# EAGLE design dm_in (EAGLE 6.5.0)
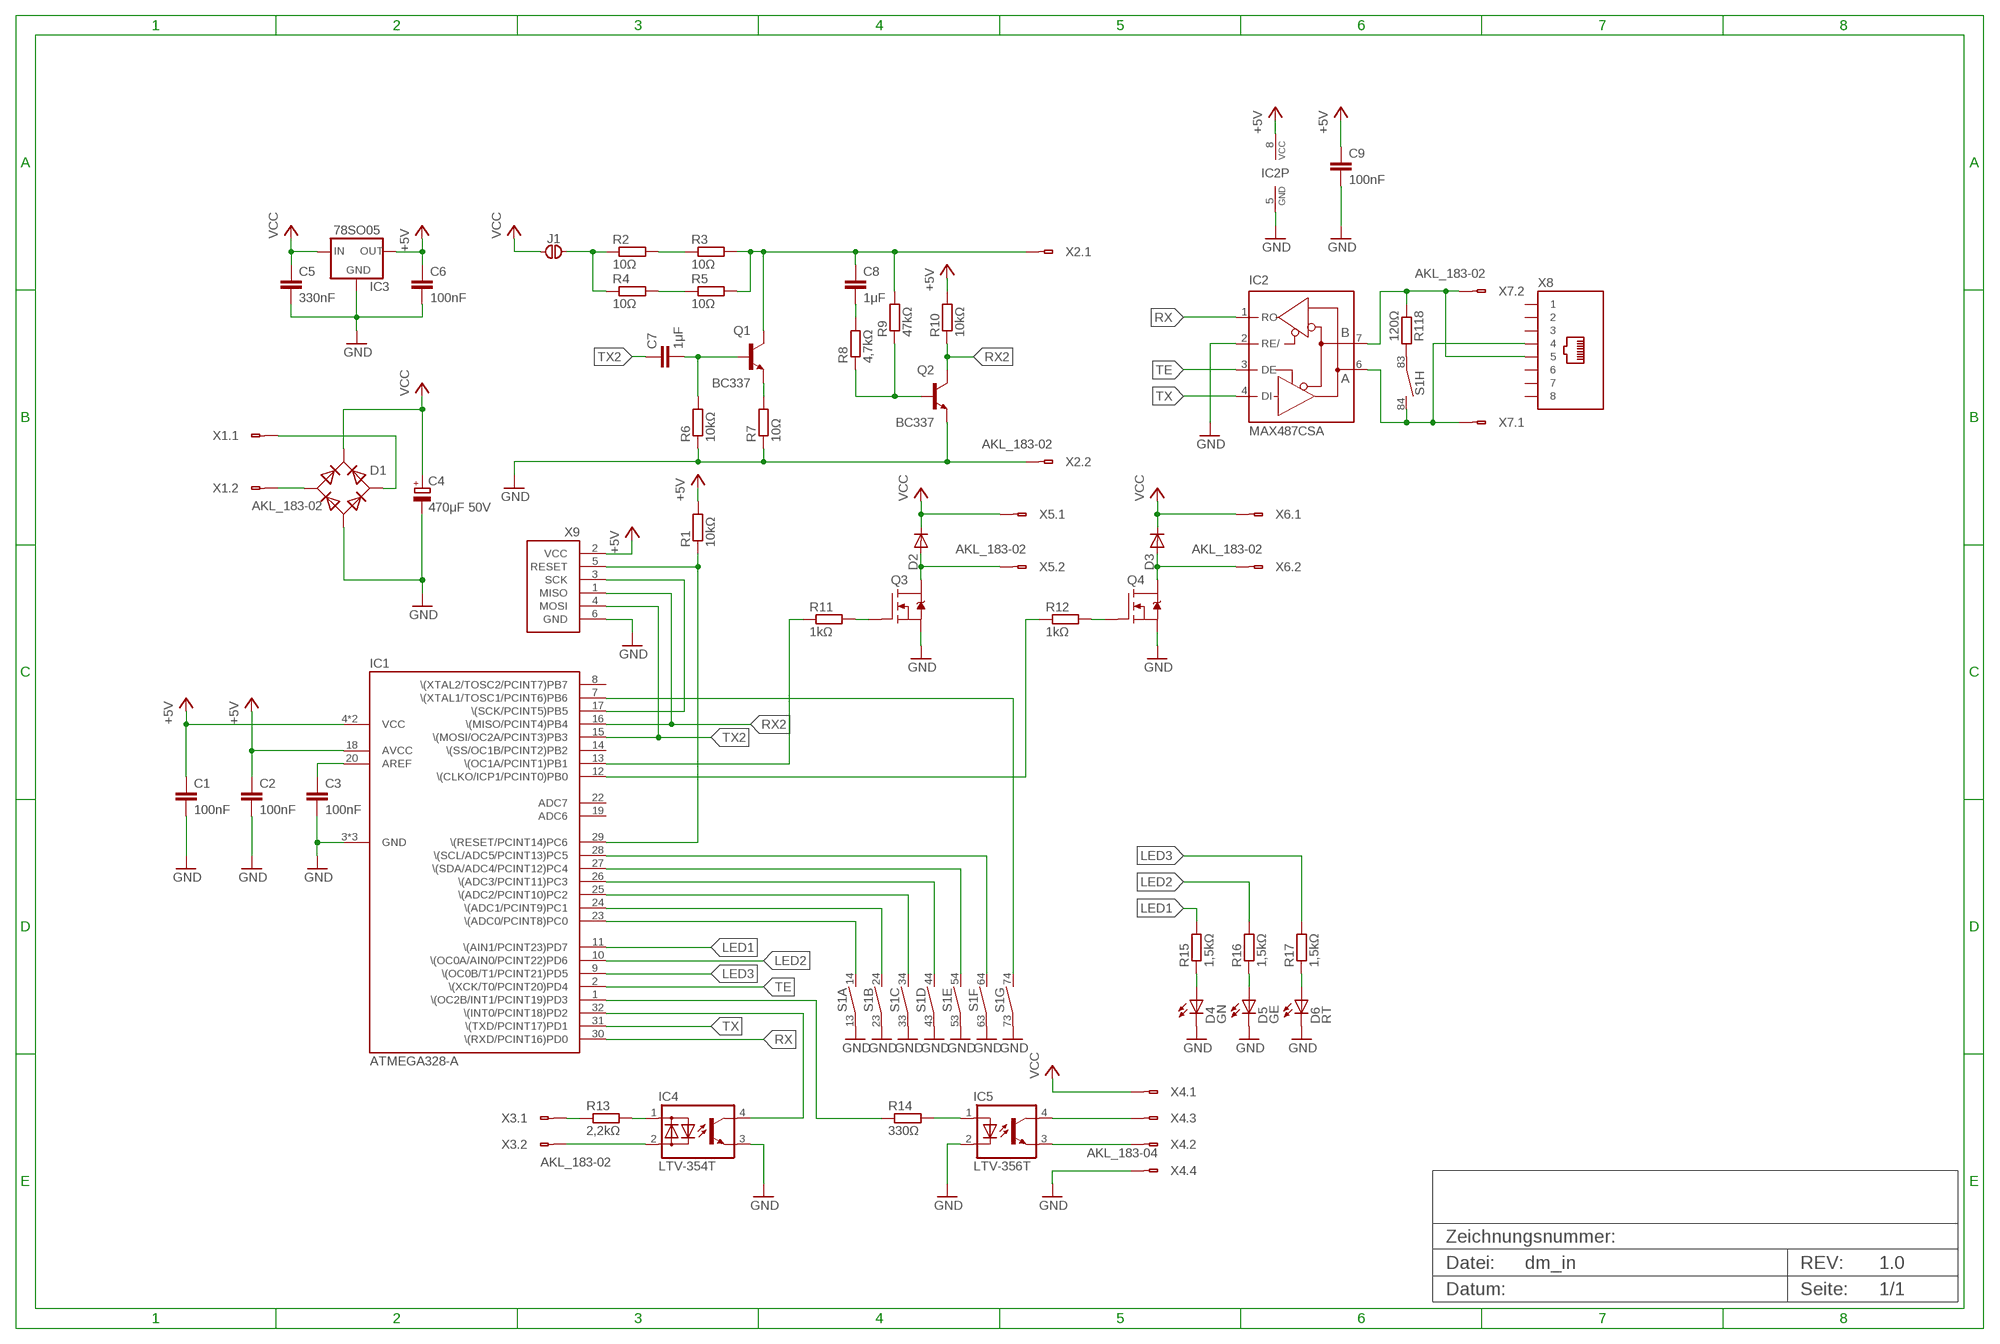
[diagram p0: schematic, sheet 1]

## Parts
C1  100nF  C_0603  [CHIP_0603]
C2  100nF  C_0603  [CHIP_0603]
C3  100nF  C_0603  [CHIP_0603]
C4  470μF 50V  C_EL_E5-13  [E5-13]
C5  330nF  C_0805  [CHIP_0805]
C6  100nF  C_0805  [CHIP_0805]
C7  1μF  C_1206  [CHIP_1206]
C8  1μF  C_1206  [CHIP_1206]
C9  100nF  C_0603  [CHIP_0603]
D1  GLEICHRICHTER-SDIP  [SDIP04_508]
D2  DIODE-SOD123  [SOD123]
D3  DIODE-SOD123  [SOD123]
D4  GN  LED_0805  [CHIP_0805]
D5  GE  LED_0805  [CHIP_0805]
D6  RT  LED_0805  [CHIP_0805]
IC1  ATMEGA328-A  [QFP32_08]
IC2  MAX487CSA  [SOP08_127]
IC3  78SO05  [SOP08_127]
IC4  LTV-354T  [SOP04_254]
IC5  LTV-356T  [SOP04_254]
J1  JUMPER  [JUMPER2]
Q1  BC337  NPN-SOT23-BEC  [SOT23]
Q2  BC337  NPN-SOT23-BEC  [SOT23]
Q3  N-MOS-SOT23-GSD  [SOT23]
Q4  N-MOS-SOT23-GSD  [SOT23]
R1  10kΩ  R_0603  [CHIP_0603]
R2  10Ω  R_1206  [CHIP_1206]
R3  10Ω  R_1206  [CHIP_1206]
R4  10Ω  R_1206  [CHIP_1206]
R5  10Ω  R_1206  [CHIP_1206]
R6  10kΩ  R_0603  [CHIP_0603]
R7  10Ω  R_1206  [CHIP_1206]
R8  4,7kΩ  R_0603  [CHIP_0603]
R9  47kΩ  R_0603  [CHIP_0603]
R10  10kΩ  R_0603  [CHIP_0603]
R11  1kΩ  R_0603  [CHIP_0603]
R12  1kΩ  R_0603  [CHIP_0603]
R13  2,2kΩ  R_0603  [CHIP_0603]
R14  330Ω  R_0603  [CHIP_0603]
R15  1,5kΩ  R_0603  [CHIP_0603]
R16  1,5kΩ  R_0603  [CHIP_0603]
R17  1,5kΩ  R_0603  [CHIP_0603]
R118  120Ω  R_0805  [CHIP_0805]
S1  DP08D  [DIP08_SMD]
X1  AKL_183-02  [AKL_183-02]
X2  AKL_183-02  [AKL_183-02]
X3  AKL_183-02  [AKL_183-02]
X4  AKL_183-04  [AKL_183-04]
X5  AKL_183-02  [AKL_183-02]
X6  AKL_183-02  [AKL_183-02]
X7  AKL_183-02  [AKL_183-02]
X8  8P8C  [C-BMJ-0102]
X9  ISP-AVR6  [ML6]

## Nets
+5V: C1.1 C2.1 C6.1 C9.1 IC1.4(VCC) IC1.6(VCC) IC1.18(AVCC) IC2.8(VCC) IC3.1(OUT) R1.2 R10.2 X9.2(VCC)
GND: C1.2 C2.2 C3.2 C4.- C5.2 C6.2 C9.2 D1.2(-) D4.2(C) D5.2(C) D6.2(C) IC1.3(GND) IC1.5(GND) IC1.21(GND) IC2.2(RE/) IC2.5(GND) IC3.2(GND) IC3.3(GND) IC3.6(GND) IC3.7(GND) IC4.3(E) IC5.2(K) Q2.2(E) Q3.2(S) Q4.2(S) R6.1 R7.1 S1.13 S1.23 S1.33 S1.43 S1.53 S1.63 S1.73 X2.2 X4.4 X9.6(GND)
LED1: IC1.11(\(AIN1/PCINT23)PD7) R15.2
LED2: IC1.10(\(OC0A/AIN0/PCINT22)PD6) R16.2
LED3: IC1.9(\(OC0B/T1/PCINT21)PD5) R17.2
N$1: IC1.32(\(INT0/PCINT18)PD2) IC4.4(C)
N$2: IC4.2(K) X3.2
N$3: IC2.6(A) S1.84 X7.1 X8.P$4
N$4: IC1.29(\(RESET/PCINT14)PC6) R1.1 X9.5(RESET)
N$5: IC1.13(\(OC1A/PCINT1)PB1) R11.1
N$6: Q3.1(G) R11.2
N$7: D2.A Q3.3(D) X5.2
N$8: IC5.3(E) X4.2
N$9: IC5.4(C) X4.3
N$10: IC1.1(\(OC2B/INT1/PCINT19)PD3) R14.1
N$11: IC5.1(A) R14.2
N$12: J1.P$2 R2.1 R4.1
N$13: R2.2 R3.1
N$14: R13.1 X3.1
N$15: IC4.1(A) R13.2
N$16: Q1.2(E) R7.2
N$17: C7.2 Q1.1(B) R6.2
N$18: Q2.1(B) R8.1 R9.1
N$19: C8.2 R8.2
N$20: D1.4(AC2) X1.1
N$21: C8.1 Q1.3(C) R3.2 R5.2 R9.2 X2.1
N$22: D1.3(AC1) X1.2
N$23: R4.2 R5.1
N$24: Q4.1(G) R12.2
N$25: D3.A Q4.3(D) X6.2
N$26: IC1.12(\(CLKO/ICP1/PCINT0)PB0) R12.1
N$27: IC2.7(B) R118.1 X7.2 X8.P$5
N$28: IC1.23(\(ADC0/PCINT8)PC0) S1.14
N$29: IC1.24(\(ADC1/PCINT9)PC1) S1.24
N$30: IC1.25(\(ADC2/PCINT10)PC2) S1.34
N$31: IC1.26(\(ADC3/PCINT11)PC3) S1.44
N$32: IC1.27(\(SDA/ADC4/PCINT12)PC4) S1.54
N$33: R118.2 S1.83
N$34: IC1.28(\(SCL/ADC5/PCINT13)PC5) S1.64
N$35: IC1.7(\(XTAL1/TOSC1/PCINT6)PB6) S1.74
N$36: D6.1(A) R17.1
N$38: IC1.17(\(SCK/PCINT5)PB5) X9.3(SCK)
N$39: C3.1 IC1.20(AREF)
N$62: D4.1(A) R15.1
N$63: D5.1(A) R16.1
RX: IC1.30(\(RXD/PCINT16)PD0) IC2.1(RO)
RX2: IC1.16(\(MISO/PCINT4)PB4) Q2.3(C) R10.1 X9.1(MISO)
TE: IC1.2(\(XCK/T0/PCINT20)PD4) IC2.3(DE)
TX: IC1.31(\(TXD/PCINT17)PD1) IC2.4(DI)
TX2: C7.1 IC1.15(\(MOSI/OC2A/PCINT3)PB3) X9.4(MOSI)
VCC: C4.+ C5.1 D1.1(+) D2.K D3.K IC3.8(IN) J1.P$1 X4.1 X5.1 X6.1
Unconnected: IC1.8(\(XTAL2/TOSC2/PCINT7)PB7) IC1.14(\(SS/OC1B/PCINT2)PB2) IC1.19(ADC6) IC1.22(ADC7) X8.P$1 X8.P$2 X8.P$3 X8.P$6 X8.P$7 X8.P$8

## Notes on the sheet
- 1.0

## Library data of the parts
C1-C3 C5-C9 = passiv:C_: CAPACITOR, European symbol
C4 = passiv:C_EL_: POLARIZED CAPACITOR, European symbol
D1 = diode:GLEICHRICHTER
D2 D3 = diode:DIODE
D4-D6 = led:LED: LED
IC1 = ic-mcu:ATMEGA328: Microcontroller Typ Flash SRAM EEPROM GPIO ADC DAC PWM Timer Ports ATmega328 <./eagle/doc/ic-mcu/atmega48a_48pa_88a_88pa_168a_168pa_328_328p.pdf> 32kB 2kB 1kB 23 8x 10bit 4x 8bit, 2x 16bit 2x 8bit, 1x 16bit JTAG, USART, I2C, SPI
IC2 = ic-wandler:MAX48*: RS485 TRANSEIVER Datasheet: max1487-max491.pdf <./eagle/doc/ic-wandler/max1487-max491.pdf> Part Number Half- / Fullduplex Datarate (Mbps) Slew-Rate limited Low-Power shutdown Receiver / Driver enable Quiescent current (μA) Number of Receivers un bus MAX481 Half 2.5 No Yes Yes 300 32 MAX483 Half 0.25 Yes Yes Yes 120 32 MAX485 Half 2.5 No No Yes 300 32 MAX487 Half 0.25 Yes Yes Yes 120 128
IC3 = ic-reg:78?*: VOLTAGE REGULATOR
IC4 = ic-optokoppler:LTV-354T: Liteon Optokoppler ltv-354t.pdf <./eagle/doc/ic-optokoppler/ltv-354t.pdf>
IC5 = ic-optokoppler:LTV-356T: Liteon Optokoppler ltv-356t.pdf <./eagle/doc/ic-optokoppler/ltv-356t.pdf>
J1 = schalter:JUMPER
Q1 Q2 = transistor:NPN: NPN Transistor Typ Variant VCEO (V) IC (mA) PD (mW) Source BC337 TO92x-EBC 45 800 625 bc337_338.pdf <./eagle/doc/transistor/bc337_338.pdf> BC546 TO92x-EBC 65 100 625 bc546.pdf <./eagle/doc/transistor/bc546.pdf> BC817 SOT23-BEC 45 500 250 bc817.pdf <./eagle/doc/transistor/bc817.pdf> BD543 TO220x-BCE 40 10A 70W bd543.pdf <./eagle/doc/transistor/bd543.pdf>
Q3 Q4 = transistor:N-MOS: N-Kanal Transistor Typ Variant VDS (V) ID (A) PD (W) Source 2N7002 SOT23-GSD 60 115 mA 200 mW 2n7000.pdf <./eagle/doc/transistor/2n7000.pdf> AO3416 SOT23-GSD 20 6,5 1,4 ao3416.pdf <./eagle/doc/transistor/ao3416.pdf>
R1-R17 R118 = passiv:R_: RESISTOR, European symbol
S1 = schalter:DP08: Piano-Dip-Schalter Datasheet: dp.pdf <./eagle/doc/schalter/dp.pdf>
X1-X3 X5-X7 = anschluss:AKL_183-02: Anschlussklemme Datasheet: akl181-183.pdf <./eagle/doc/anschluss/akl181-183.pdf> Gegenstück: AKL169
X4 = anschluss:AKL_183-04: Anschlussklemme Datasheet: akl181-183.pdf <./eagle/doc/anschluss/akl181-183.pdf> Gegenstück: AKL169
X8 = stecker:8P8C
X9 = stecker:ISP

## Net classes
2 buspower: clearance 0.5 mm to class 0, clearance 3 mm to class 1, clearance 0.5 mm

## Board
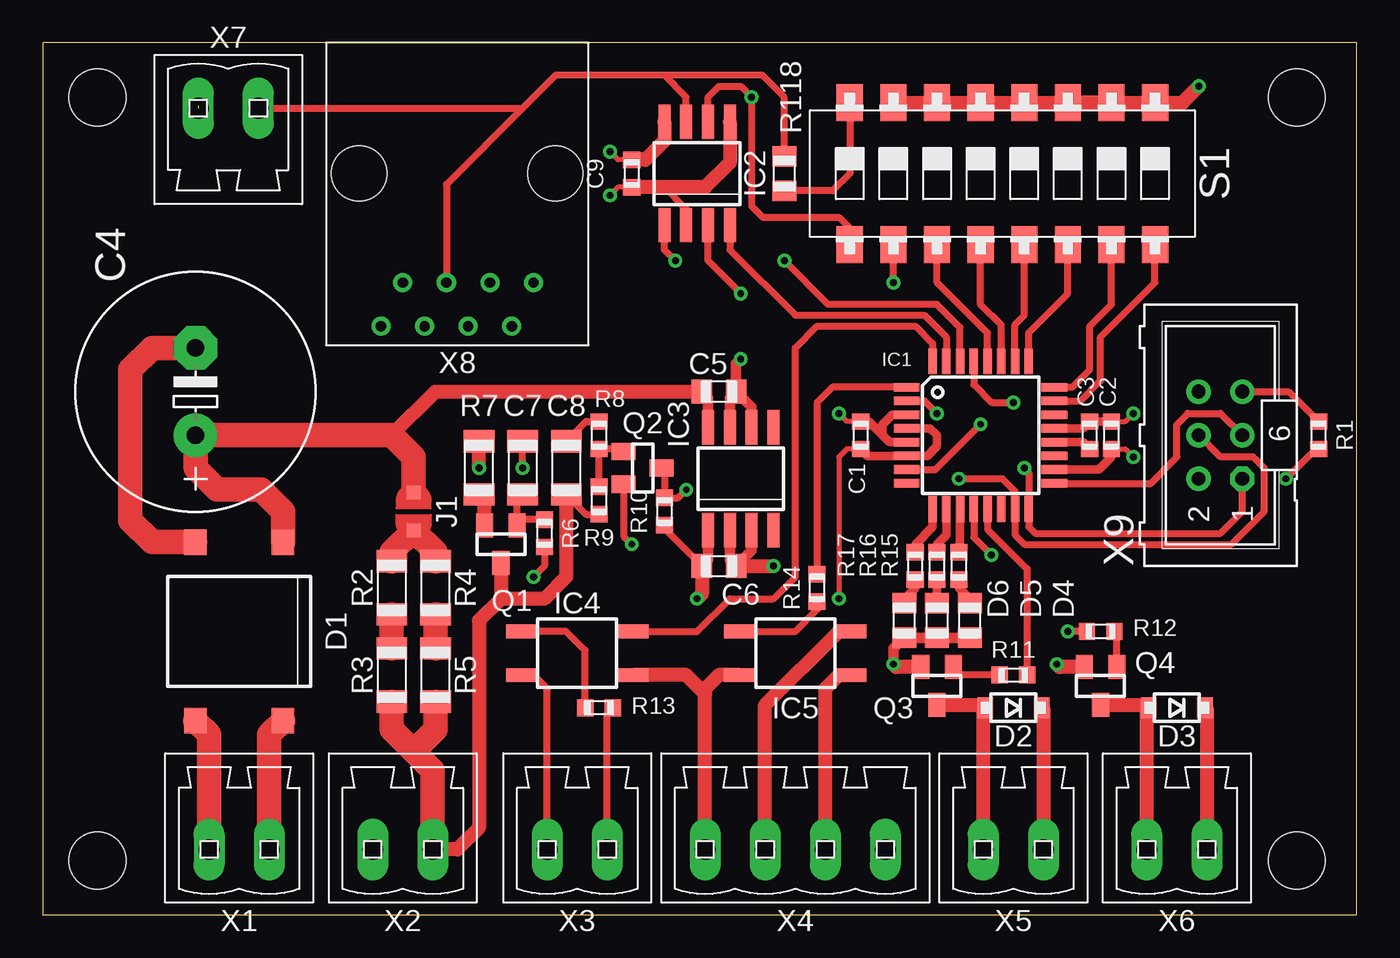
[diagram p1: board, top side]
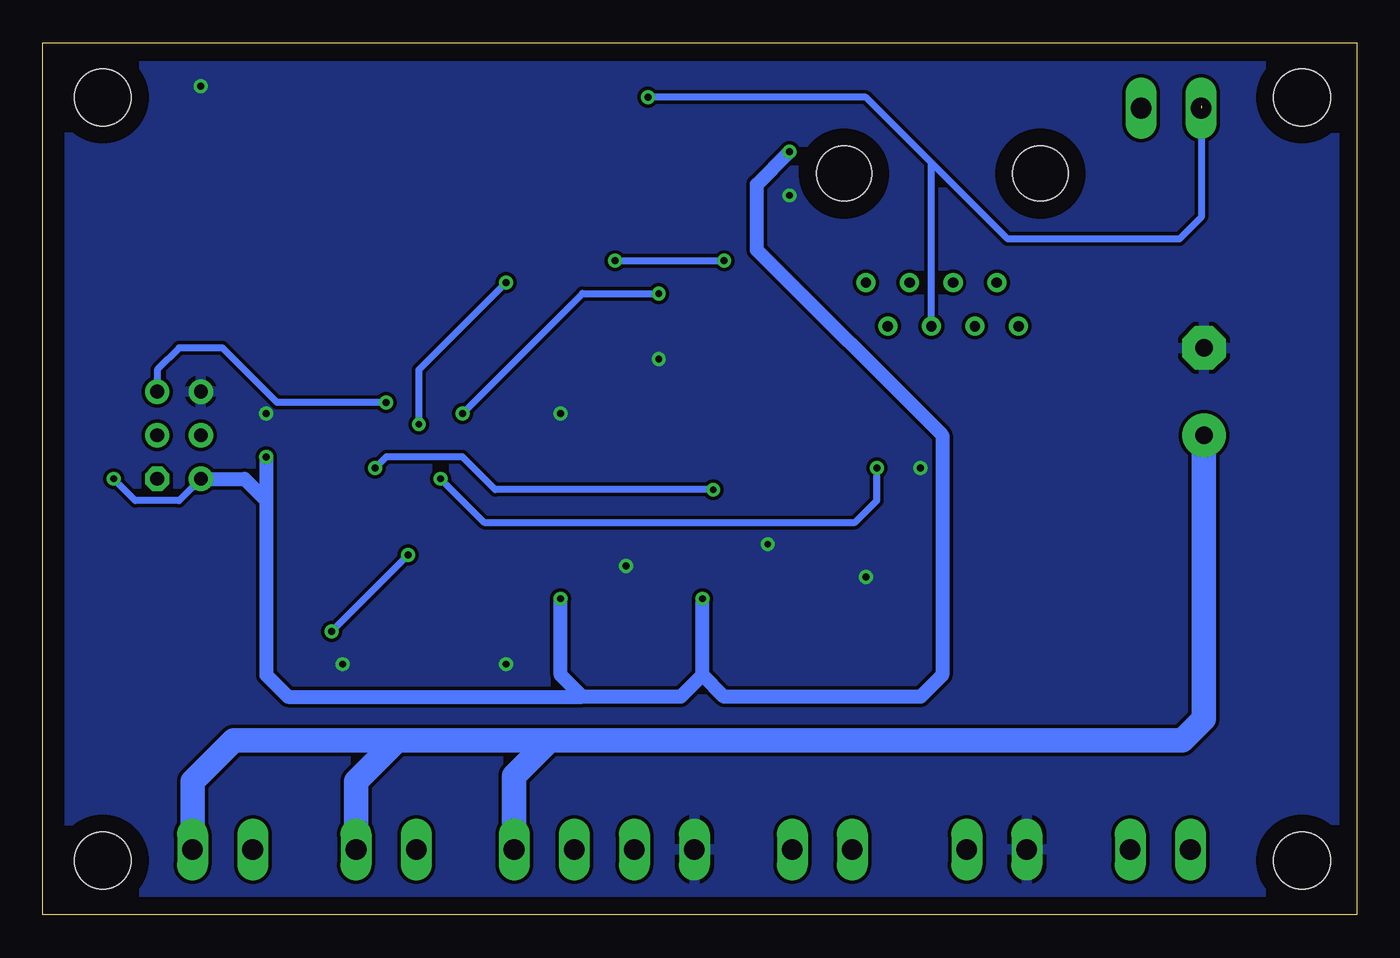
[diagram p2: board, bottom side, seen from below]

Size 76.5 x 50.79 mm. Coordinates in mm from the lower left corner, seen from the top.
Outline: 0,0 76.5,0 76.5,50.79 0,50.79 0,0
Copper layers (1*16): Top 0.035mm / dielectric 1.5mm / Bottom 0.035mm
Design rules "default *": minimum track width 10mil, minimum drill 0.25mm, track to track 8mil, track to pad 8mil, pad to pad 8mil, via to via 8mil, smd to smd 8mil, copper to edge 40mil, drill to drill 8mil, minimum pad ring 10mil, minimum via ring 8mil, stop-mask expansion 4mil, vias tented up to drill 0mil, thermal gap 10mil
Holes 3.3 mm at 3.17,47.62 3.17,3.17 73.03,3.17 73.03,47.62

### Footprints (pad centres in the part's own frame; a part is rotated, then mirrored left to right if it is on the bottom)
CHIP_0603 = smd 0.95 x 1: 1 -0.8,0; 2 0.8,0
E5-13 = drill 1.016 pad 2.54: + -2.54,0 | drill 1.016 pad 2.54 octagon: - 2.54,0
CHIP_0805 = smd 1.2 x 1.4: 1 -1,0; 2 1,0
CHIP_1206 = smd 1.3 x 1.8: 1 -1.55,0; 2 1.55,0
SDIP04_508 = smd 1.3 x 1.5: 1 -2.55,-5.2; 2 2.55,-5.2; 3 2.55,5.2; 4 -2.55,5.2
SOD123 = smd 0.9 x 1.2: A 1.65,0; K -1.65,0
QFP32_08 = smd 1.5 x 0.5: 1 -4.3,2.8; 2 -4.3,2; 3 -4.3,1.2; 4 -4.3,0.4; 5 -4.3,-0.4; 6 -4.3,-1.2; 7 -4.3,-2; 8 -4.3,-2.8; 17 4.3,-2.8; 18 4.3,-2; 19 4.3,-1.2; 20 4.3,-0.4; 21 4.3,0.4; 22 4.3,1.2; 23 4.3,2; 24 4.3,2.8 | smd 0.5 x 1.5: 9 -2.8,-4.3; 10 -2,-4.3; 11 -1.2,-4.3; 12 -0.4,-4.3; 13 0.4,-4.3; 14 1.2,-4.3; 15 2,-4.3; 16 2.8,-4.3; 25 2.8,4.3; 26 2,4.3; 27 1.2,4.3; 28 0.4,4.3; 29 -0.4,4.3; 30 -1.2,4.3; 31 -2,4.3; 32 -2.8,4.3
SOP08_127 = smd 0.7 x 2: 1 -1.905,-3; 2 -0.635,-3; 3 0.635,-3; 4 1.905,-3; 5 1.905,3; 6 0.635,3; 7 -0.635,3; 8 -1.905,3
SOP04_254 = smd 0.8 x 1.8: 1 -1.27,-3.25; 2 1.27,-3.25; 3 1.27,3.25; 4 -1.27,3.25
JUMPER2 = smd 0.8 x 0.8: P$1 -1.1,0; P$2 1.1,0
SOT23 = smd 1 x 1.4: 1 -0.95,-1.1; 2 0.95,-1.1; 3 0,1.1
DIP08_SMD = smd 1.524 x 2.159: 13 -8.89,-4.128; 14 -8.89,4.128; 23 -6.35,-4.128; 24 -6.35,4.128; 33 -3.81,-4.128; 34 -3.81,4.128; 43 -1.27,-4.128; 44 -1.27,4.128; 53 1.27,-4.128; 54 1.27,4.128; 63 3.81,-4.128; 64 3.81,4.128; 73 6.35,-4.128; 74 6.35,4.128; 83 8.89,-4.128; 84 8.89,4.128
AKL_183-02 = drill 1.2 long: 1 -1.75,0; 2 1.75,0
AKL_183-04 = drill 1.2 long: 1 -5.25,0; 2 -1.75,0; 3 1.75,0; 4 5.25,0
C-BMJ-0102 = drill 0.6: P$1 -4.445,6.35; P$2 -3.175,8.89; P$3 -1.905,6.35; P$4 -0.635,8.89; P$5 0.635,6.35; P$6 1.905,8.89; P$7 3.175,6.35; P$8 4.445,8.89 | hole 3.2: -5.715,0; 5.715,0
ML6 = drill 0.8 pad 1.422 octagon: 1 -2.54,-1.27 | drill 0.8 pad 1.422: 2 -2.54,1.27; 3 0,-1.27; 4 0,1.27; 5 2.54,-1.27; 6 2.54,1.27

### Placement (x,y rotation side)
C1  47.62,27.94 90 top
C2  62.23,27.94 90 top
C3  60.96,27.94 90 top
C4  8.89,30.48 90 top
C5  39.37,30.48 0 top
C6  39.37,20.32 0 top
C7  27.94,26.04 270 top
C8  30.48,26.04 90 top
C9  34.29,43.18 270 top
D1  11.43,16.51 180 top
D2  56.52,12.06 180 top
D3  66.04,12.06 180 top
D4  53.98,17.14 270 top
D5  52.07,17.14 270 top
D6  50.16,17.14 270 top
IC1  54.61,27.94 0 top
IC2  38.1,43.18 0 top
IC3  40.64,25.4 0 top
IC4  31.11,15.24 270 top
IC5  43.81,15.24 270 top
J1  21.59,23.5 270 top
Q1  26.67,21.59 180 top
Q2  34.92,26.04 270 top
Q3  52.07,13.34 180 top
Q4  61.59,13.34 180 top
R1  74.3,27.94 270 top
R2  20.32,19.05 270 top
R3  20.32,13.97 270 top
R4  22.86,19.05 270 top
R5  22.86,13.97 270 top
R6  29.21,22.23 90 top
R7  25.4,26.04 270 top
R8  32.38,27.94 90 top
R9  32.38,24.13 270 top
R10  36.2,23.5 270 top
R11  56.52,13.97 180 top
R12  61.59,16.51 0 top
R13  32.38,12.06 180 top
R14  45.09,19.05 270 top
R15  53.34,20.32 90 top
R16  52.07,20.32 90 top
R17  50.8,20.32 90 top
R118  43.18,43.18 270 top
S1  55.88,43.18 180 top
X1  11.43,3.81 180 top
X2  20.95,3.81 180 top
X3  31.11,3.81 180 top
X4  43.81,3.81 180 top
X5  56.52,3.81 180 top
X6  66.04,3.81 180 top
X7  10.79,46.99 0 top
X8  24.13,43.18 180 top
X9  68.58,27.94 90 top

### Tracks (layer width: path | path; a pad name or v marks a point on that pad's centre or on a via)
+5V  (via drill 0.4)
  Top 0.305: C2.1 63.03,27.14 v63.5,26.67 | C1.1 46.83,27.14 46.35,26.67 v46.35,18.41 | C9.1 33.49,43.98 v33.02,44.45 | 74.3,27.3 R1.2
  Top 0.406: R10.2 36.2,22.5 C6.1 | v72.39,25.4 74.3,27.3
  Top 0.508: C1.1 48.02,26.74 IC1.6 51.51,26.74 52.07,27.3 52.07,27.94 51.67,28.34 IC1.4 | IC1.18 61.5,25.94 62.23,26.67 C2.1
  Top 0.61: IC3.1 38.73,20.68 C6.1
  Top 0.813: v38.1,18.41 38.37,18.68 C6.1 | IC2.8 36.2,45.09 35.09,43.98 C9.1
  Bottom 0.406: X9.2 68.58,24.13 71.12,24.13 v72.39,25.4
  Bottom 0.813: 38.1,13.97 39.37,12.7 45.09,12.7 | 45.09,12.7 46.35,13.97 v46.35,18.41 | v63.5,26.67 63.5,24.13 | 63.5,24.13 63.5,13.97 62.23,12.7 45.09,12.7 | X9.2 64.77,25.4 63.5,24.13 | 38.1,13.97 36.83,12.7 25.4,12.7 24.13,13.97 24.13,27.94 34.92,38.73 34.92,42.55 v33.02,44.45 | 38.1,13.97 v38.1,18.41
GND  (via drill 0.4)
  Top 0.305: C2.2 63.03,28.74 v63.5,29.21 | C1.2 46.83,28.74 v46.35,29.21 | C9.2 33.49,42.38 v33.02,41.91
  Top 0.406: R6.1 29.21,20.32 v28.57,19.68 | Q2.2 33.83,22.05 v34.29,21.59 | IC2.2 37.47,41.11 36.2,42.38
  Top 0.508: C2.2 C3.2 60.56,28.34 IC1.21 | IC1.5 49.3,27.54 48.9,27.94 | IC1.3 49.46,29.14 48.9,28.57 48.9,27.94 | C1.2 48.09,28.74 48.9,27.94
  Top 0.61: IC3.7 40.01,30.11 C5.2 | IC3.6 41.27,29.57 C5.2 | C5.2 40.37,32.12 v40.64,32.38 | IC3.3 41.27,21.23 C6.2 40.01,20.68 IC3.2 | D4.2 D5.2 D6.2 49.53,15.51 v49.53,14.61
  Top 0.813: X4.4 38.56,12.87 38.42,13.02 | 38.42,13.02 37.47,13.97 IC4.3 | IC5.2 39.37,13.97 38.42,13.02 | v25.4,26.04 R7.1 | Q3.2 49.7,14.44 v49.53,14.61 | Q4.2 59.23,14.44 v59.05,14.61 | S1.73 S1.63 S1.53 S1.43 S1.33 S1.23 S1.13 66.36,47.31 v67.31,48.26 | IC2.5 40.01,43.81 38.57,42.38 36.2,42.38 C9.2 | C6.2 v42.55,20.32
  Top 1.422: D1.2 6.35,21.71 5.08,22.98 5.08,31.75 6.35,33.02 C4.-
  pour Bottom: 1.27,49.53 74.93,49.53 74.93,1.27 1.27,1.27
LED1
  Top 0.508: IC1.11 53.41,21.82 R15.2
LED2
  Top 0.508: IC1.10 52.61,22.13 52.07,21.59 R16.2
LED3
  Top 0.508: IC1.9 51.81,22.6 50.8,21.59 R17.2
N$1
  Top 0.406: IC4.4 38.1,16.51 40.01,18.41 42.55,18.41 43.81,19.68 43.81,33.02 45.09,34.29 50.8,34.29 51.81,33.28 IC1.32
N$2
  Top 0.406: X3.2 29.36,13.18 28.57,13.97 IC4.2
N$3  (via drill 0.4)  (1 unrouted)
  Top 0.406: IC2.6 38.73,47.62 39.37,48.26 40.64,48.26 v41.27,47.62 41.27,41.27 41.91,40.64 46.35,40.64 46.99,40.01 S1.84
  Bottom 0.406: X8.P$4 24.77,43.81 | 24.77,43.81 28.57,47.62 v41.27,47.62 | 9.04,47.15 9.04,40.64 10.31,39.37 20.32,39.37 24.77,43.81
N$4  (via drill 0.4)
  Top 0.406: IC1.29 54.21,30.88 55.24,29.84 v56.52,29.84 | X9.5 72.56,30.48 R1.1
  Bottom 0.406: v56.52,29.84 62.87,29.84 66.04,33.02 68.58,33.02 69.85,31.75 X9.5
N$5
  Top 0.406: IC1.13 55.01,22.46 57.31,20.16 R11.1
N$6
  Top 0.406: R11.2 53.48,13.97 Q3.1
N$7
  Top 0.813: Q3.3 54.7,12.23 D2.A 54.77,11.96 X5.2
N$8
  Top 0.813: X4.2 45.56,13.18 46.35,13.97 IC5.3
N$9
  Top 0.813: X4.3 42.06,12.22 46.35,16.51 IC5.4
N$10
  Top 0.406: IC1.1 45.98,30.74 45.09,29.84 R14.1
N$11
  Top 0.406: IC5.1 43.81,16.51 45.09,17.78 R14.2
N$12
  Top 1.422: R2.1 20.32,21.12 J1.P$2 22.86,21.12 R4.1
N$13
  Top 1.422: R3.1 R2.2
N$14
  Top 0.406: X3.1 32.87,11.74 R13.1
N$15
  Top 0.406: R13.2 31.59,15.4 30.48,16.51 IC4.1
N$16
  Top 0.813: Q1.2 25.72,24.16 arc90 R7.2
N$17
  Top 0.406: C7.2 27.62,24.16 Q1.1 arc-90 27.95,23.02 R6.2
N$18
  Top 0.406: R9.1 R8.1 33.67,27.14 Q2.1
N$19
  Top 0.406: C8.2 31.64,28.74 R8.2
N$20
  Top 1.422: D1.4 13.18,10.51 X1.1
N$21
  Top 0.406: C8.1 31.64,23.33 R9.2
  Top 0.813: Q1.3 26.67,18.41 | 26.67,18.41 25.4,17.14 25.4,5.08 24.13,3.81 X2.1 | C8.1 30.48,19.68 29.21,18.41 26.67,18.41
  Top 1.422: X2.1 22.7,8.41 21.59,9.53 | 21.59,9.53 20.32,10.79 R3.2 | R5.2 22.86,10.79 21.59,9.53
N$22
  Top 1.422: D1.3 9.68,10.51 X1.2
N$23
  Top 1.422: R5.1 R4.2
N$24
  Top 0.406: Q4.1 62.55,16.36 R12.2
N$25
  Top 0.813: X6.2 64.29,11.96 D3.A 64.22,12.23 Q4.3
N$26  (via drill 0.4)
  Top 0.406: IC1.12 54.21,21.99 v55.24,20.95 | R12.1 v59.69,16.51
  Bottom 0.406: v55.24,20.95 v59.69,16.51
N$27
  Top 0.406: X8.P$5 23.5,42.55 27.94,46.99 | IC2.7 37.47,47.62 36.2,48.9 | 36.2,48.9 29.84,48.9 27.94,46.99 | R118.1 43.18,47.62 41.91,48.9 36.2,48.9 | X7.2 27.94,46.99
N$28
  Top 0.406: IC1.23 60.42,29.94 61.59,31.11 61.59,33.66 64.77,36.83 S1.14
N$29
  Top 0.406: IC1.24 59.95,30.74 60.96,31.75 60.96,34.29 62.23,35.56 S1.24
N$30
  Top 0.406: IC1.25 57.41,33.91 59.69,36.2 S1.34
N$31
  Top 0.406: IC1.26 56.61,34.38 57.15,34.92 S1.44
N$32
  Top 0.406: IC1.27 55.81,34.36 54.61,35.56 S1.54
N$33
  Top 0.406: S1.83 46.99,43.18 45.99,42.18 R118.2
N$34
  Top 0.406: IC1.28 55.01,33.89 52.07,36.83 S1.64
N$35  (via drill 0.4)
  Top 0.406: IC1.7 51.98,25.94 v54.61,28.57 | v49.53,36.83 S1.74
  Bottom 0.406: v54.61,28.57 54.61,31.75 v49.53,36.83
N$36
  Top 0.508: R17.1 50.8,19.05 50.16,18.41 D6.1
N$38
  Top 0.406: IC1.17 64.51,25.14 66.04,26.67 66.04,28.57 66.67,29.21 68.58,29.21 X9.3
N$39
  Top 0.508: IC1.20 60.56,27.54 C3.1
N$62
  Top 0.508: R15.1 53.34,19.05 53.98,18.41 D4.1
N$63
  Top 0.508: R16.1 D5.1
RX  (via drill 0.4)
  Top 0.406: IC1.30 53.41,34.22 52.07,35.56 45.72,35.56 v43.18,38.1 | v36.83,38.1 36.2,38.73 IC2.1
  Bottom 0.406: v43.18,38.1 v36.83,38.1
RX2  (via drill 0.4)
  Top 0.406: Q2.3 36.2,25.86 R10.1 36.99,24.3 v37.47,24.77 | X9.1 69.85,23.5 68.58,22.23 57.78,22.23 57.41,22.6 IC1.16 57.41,25.77 v57.15,26.04
  Bottom 0.406: v37.47,24.77 50.16,24.77 52.07,26.67 56.52,26.67 v57.15,26.04
TE  (via drill 0.4)
  Top 0.406: IC1.2 51.34,29.94 v52.07,29.21 | v40.64,36.2 38.73,38.1 IC2.3
  Bottom 0.406: v52.07,29.21 45.09,36.2 v40.64,36.2
TX
  Top 0.406: IC2.4 40.01,38.73 43.81,34.92 51.34,34.92 52.61,33.66 IC1.31
TX2  (via drill 0.4)
  Top 0.406: X9.4 68.58,26.67 70.48,26.67 71.12,26.04 71.12,23.5 69.22,21.59 57.15,21.59 56.61,22.13 IC1.15 56.61,24.67 55.88,25.4 v53.34,25.4 | v27.94,26.04 C7.1
  Bottom 0.406: v53.34,25.4 50.8,22.86 29.21,22.86 27.94,24.13 v27.94,26.04
VCC
  Top 0.61: IC3.8 38.73,30.11 C5.1
  Top 0.813: D2.K 58.27,11.96 X5.1 | C5.1 22.86,30.48 20.32,27.94 | D3.K 67.79,11.96 X6.1
  Top 1.422: J1.P$1 21.59,26.67 20.32,27.94 C4.+ 8.89,26.04 10.16,24.77 12.71,24.77 13.98,23.5 D1.1
  Bottom 1.422: X5.1 58.27,7.78 55.88,10.16 | 55.88,10.16 46.99,10.16 | 46.99,10.16 10.16,10.16 8.89,11.43 C4.+ | X6.1 67.79,7.78 65.41,10.16 55.88,10.16 | X4.1 49.06,8.09 46.99,10.16